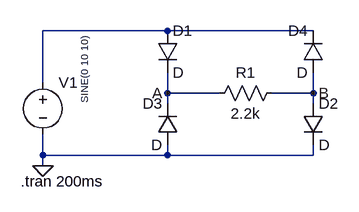
[diagram p0: schematic circuito_4_lab_1.asc]
circuito_4_lab_1.asc, the LTspice schematic file:
Version 4
SHEET 1 880 680
WIRE 208 64 16 64
WIRE 432 64 208 64
WIRE 16 144 16 64
WIRE 208 160 208 128
WIRE 288 160 208 160
WIRE 432 160 432 128
WIRE 432 160 368 160
WIRE 208 176 208 160
WIRE 432 176 432 160
WIRE 16 256 16 224
WIRE 208 256 208 240
WIRE 208 256 16 256
WIRE 432 256 432 240
WIRE 432 256 208 256
WIRE 16 272 16 256
FLAG 16 272 0
FLAG 208 160 A
FLAG 432 160 B
SYMBOL voltage 16 128 R0
WINDOW 3 64 -54 VRight 1
WINDOW 123 0 0 Left 0
WINDOW 39 0 0 Left 0
SYMATTR InstName V1
SYMATTR Value SINE(0 10 10)
SYMBOL diode 192 64 R0
SYMATTR InstName D1
SYMBOL diode 224 240 R180
WINDOW 0 24 64 Left 2
WINDOW 3 24 0 Left 2
SYMATTR InstName D3
SYMBOL res 384 144 R90
WINDOW 0 0 56 VBottom 2
WINDOW 3 32 56 VTop 2
SYMATTR InstName R1
SYMATTR Value 2.2k
SYMBOL diode 416 176 R0
SYMATTR InstName D2
SYMBOL diode 448 128 R180
WINDOW 0 24 64 Left 2
WINDOW 3 24 0 Left 2
SYMATTR InstName D4
TEXT -18 296 Left 2 !.tran 200ms

The netlist it stands for:
* circuito_4_lab_1.asc
V1 N001 0 SINE(0 10 10)
D1 N001 A D
D3 0 A D
R1 B A 2.2k
D2 B 0 D
D4 B N001 D
.model D D
.lib standard.dio
.tran 200ms
.backanno
.end